# Altium schematic sheet Sheet3.SchDoc
size A1
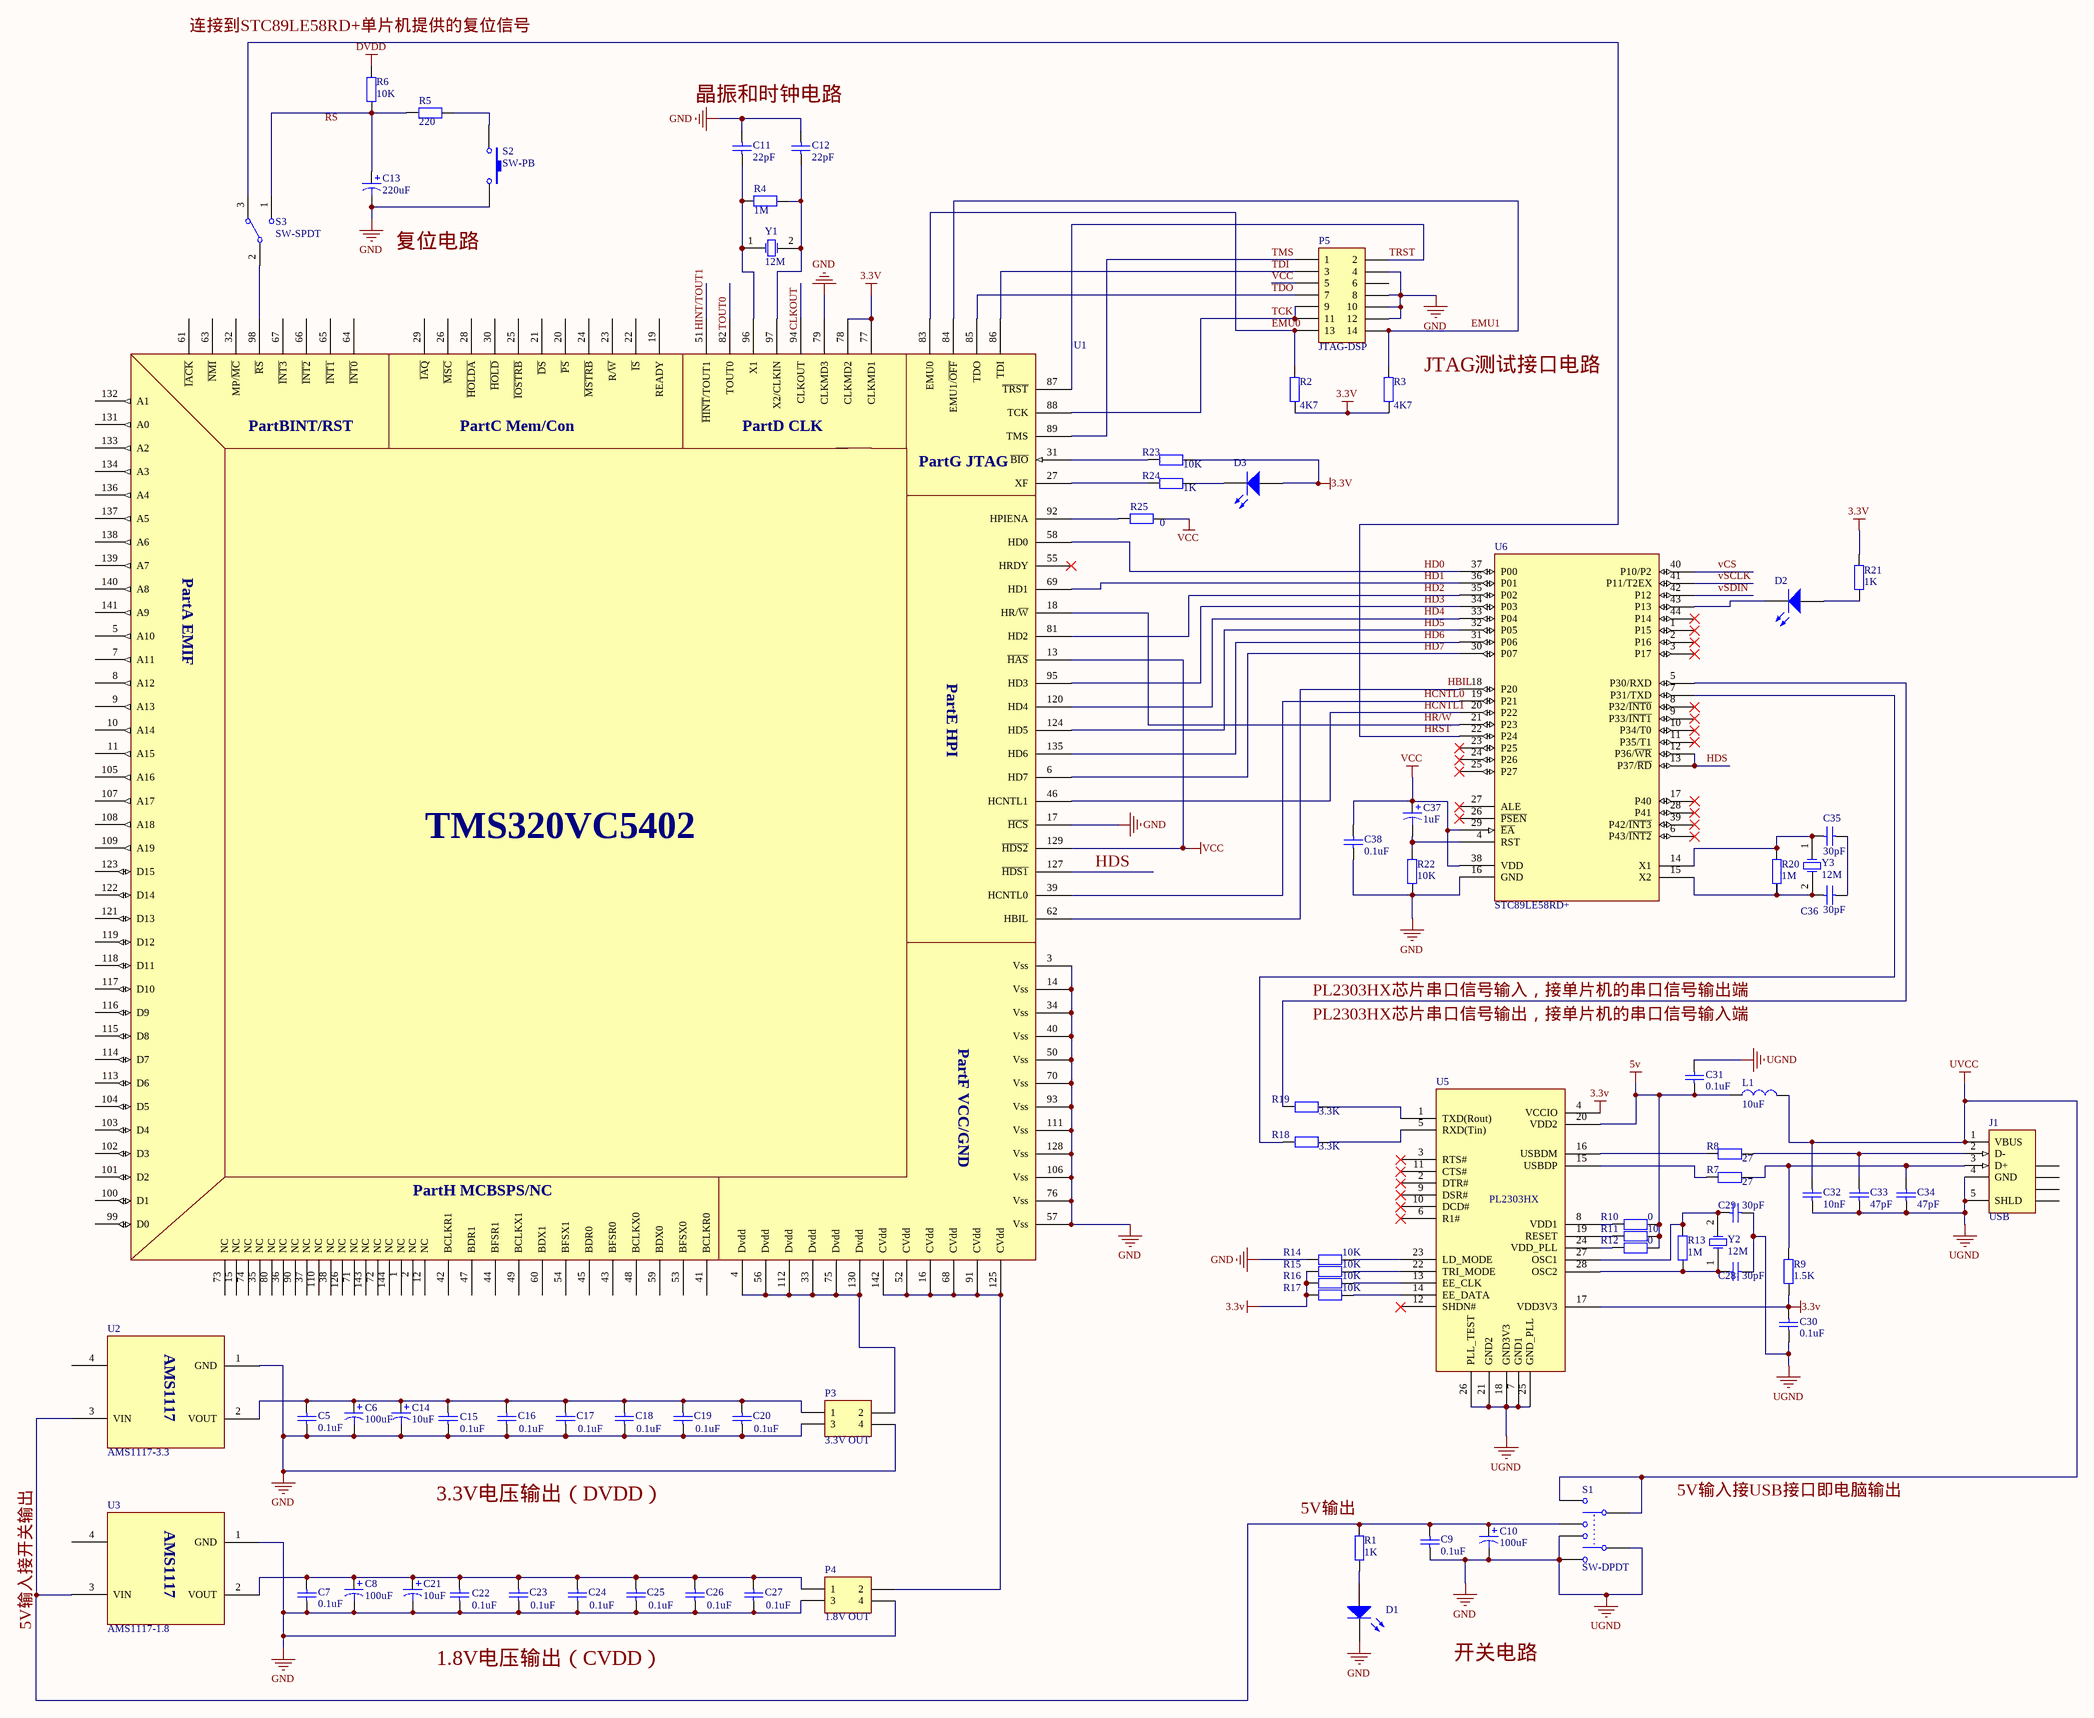
[diagram p0: Sheet3.SchDoc]

## Parts
C5  value 0.1uF  [RAD-0.3]  (hidden comment: Cap)
C6  value 100uF  [RB7.6-15]  (hidden comment: Cap Pol1)
C7  value 0.1uF  [RAD-0.3]  (hidden comment: Cap)
C8  value 100uF  [RB7.6-15]  (hidden comment: Cap Pol1)
C9  value 0.1uF  [RAD-0.3]  (hidden comment: Cap)
C10  value 100uF  [RB7.6-15]  (hidden comment: Cap Pol1)
C11  value 22pF  [RAD-0.3]  (hidden comment: Cap)
C12  value 22pF  [RAD-0.3]  (hidden comment: Cap)
C13  value 220uF  [RB7.6-15]  (hidden comment: Cap Pol1)
C14  value 10uF  [RB7.6-15]  (hidden comment: Cap Pol1)
C15  value 0.1uF  [RAD-0.3]  (hidden comment: Cap)
C16  value 0.1uF  [RAD-0.3]  (hidden comment: Cap)
C17  value 0.1uF  [RAD-0.3]  (hidden comment: Cap)
C18  value 0.1uF  [RAD-0.3]  (hidden comment: Cap)
C19  value 0.1uF  [RAD-0.3]  (hidden comment: Cap)
C20  value 0.1uF  [RAD-0.3]  (hidden comment: Cap)
C21  value 10uF  [RB7.6-15]  (hidden comment: Cap Pol1)
C22  value 0.1uF  [RAD-0.3]  (hidden comment: Cap)
C23  value 0.1uF  [RAD-0.3]  (hidden comment: Cap)
C24  value 0.1uF  [RAD-0.3]  (hidden comment: Cap)
C25  value 0.1uF  [RAD-0.3]  (hidden comment: Cap)
C26  value 0.1uF  [RAD-0.3]  (hidden comment: Cap)
C27  value 0.1uF  [RAD-0.3]  (hidden comment: Cap)
C28  value 30pF  [RAD-0.3]  (hidden comment: 28)
C29  value 30pF  [RAD-0.3]  (hidden comment: Cap)
C30  value 0.1uF  [RAD-0.3]  (hidden comment: Cap)
C31  value 0.1uF  [RAD-0.3]  (hidden comment: Cap)
C32  value 10nF  [RAD-0.3]  (hidden comment: Cap)
C33  value 47pF  [RAD-0.3]  (hidden comment: Cap)
C34  value 47pF  [RAD-0.3]  (hidden comment: Cap)
C35  value 30pF  [RAD-0.3]  (hidden comment: Cap)
C36  value 30pF  [RAD-0.3]  (hidden comment: 28)
C37  value 1uF  [RB7.6-15]  (hidden comment: Cap Pol1)
C38  value 0.1uF  [RAD-0.3]  (hidden comment: Cap)
D1  LED0  [LED-0]  (value not drawn)
D2  LED0  [LED-0]  (value not drawn)
D3  LED0  [LED-0]  (value not drawn)
J1  USB  [440247]
L1  10uF  [SLF10145]
P3  3.3V OUT  [HDR2X2]
P4  1.8V OUT  [HDR2X2]
P5  JTAG-DSP  [HDR2X7]
R1  value 1K  [AXIAL-0.4]  (hidden comment: Res2)
R2  value 4K7  [AXIAL-0.4]  (hidden comment: Res2)
R3  value 4K7  [AXIAL-0.4]  (hidden comment: Res2)
R4  value 1M  [AXIAL-0.4]  (hidden comment: Res2)
R5  value 220  [AXIAL-0.4]  (hidden comment: Res2)
R6  value 10K  [AXIAL-0.4]  (hidden comment: Res2)
R7  value 27  [AXIAL-0.4]  (hidden comment: Res2)
R8  value 27  [AXIAL-0.4]  (hidden comment: Res2)
R9  value 1.5K  [AXIAL-0.4]  (hidden comment: Res2)
R10  value 0  [AXIAL-0.4]  (hidden comment: Res2)
R11  value 10  [AXIAL-0.4]  (hidden comment: Res2)
R12  value 0  [AXIAL-0.4]  (hidden comment: Res2)
R13  value 1M  [AXIAL-0.4]  (hidden comment: Res2)
R14  value 10K  [AXIAL-0.4]  (hidden comment: Res2)
R15  value 10K  [AXIAL-0.4]  (hidden comment: Res2)
R16  value 10K  [AXIAL-0.4]  (hidden comment: Res2)
R17  value 10K  [AXIAL-0.4]  (hidden comment: Res2)
R18  value 3.3K  [AXIAL-0.4]  (hidden comment: Res2)
R19  value 3.3K  [AXIAL-0.4]  (hidden comment: Res2)
R20  value 1M  [AXIAL-0.4]  (hidden comment: Res2)
R21  value 1K  [AXIAL-0.4]  (hidden comment: Res2)
R22  value 10K  [AXIAL-0.4]  (hidden comment: Res2)
R23  value 10K  [AXIAL-0.4]  (hidden comment: Res2)
R24  value 1K  [AXIAL-0.4]  (hidden comment: Res2)
R25  value 0  [AXIAL-0.4]  (hidden comment: Res2)
S1  SW-DPDT  [DPDT-6]
S2  SW-PB  [SPST-2]
S3  SW-SPDT  [TL36WW15050]
U1  Component_1  (value not drawn)
U2  AMS1117-3.3
U3  AMS1117-1.8
U5  PL2303HX
U6  STC89LE58RD+
Y1  12M  [R38]
Y2  12M  [R38]
Y3  12M  [R38]

## Nets
3.3v: C30.2 D3.1(A) R2.1 R3.1 R9.1 R15.1 R16.1 R17.1 R21.2 R23.2 U1.77(CLKMD1) U1.78(CLKMD2) U5.4(VCCIO) U5.17(VDD3V3)
5v: C31.2 L1.2 R10.2 R11.2 R12.2 U5.20(VDD2)
DVDD: R6.2
GND: C5.1 C6.2 C7.1 C8.2 C9.1 C10.2 C11.1 C12.1 C13.2 C14.2 C15.1 C16.1 C17.1 C18.1 C19.1 C20.1 C21.2 C22.1 C23.1 C24.1 C25.1 C26.1 C27.1 C28.2 C29.2 C30.1 C31.1 C32.1 C33.1 C34.2 C38.1 D1.2(K) J1.4(GND) J1.5(SHLD) P3.3 P3.4 P4.3 P4.4 P5.4 P5.8 P5.10 P5.12 R14.1 R22.1 S1.1 S1.2 S1.3 S2.2 U1.3(Vss) U1.14(Vss) U1.17(~{HCS}) U1.34(Vss) U1.40(Vss) U1.50(Vss) U1.57(Vss) U1.70(Vss) U1.76(Vss) U1.79(CLKMD3) U1.93(Vss) U1.106(Vss) U1.111(Vss) U1.128(Vss) U2.1(GND) U3.1(GND) U5.7(GND1) U5.18(GND3V3) U5.21(GND2) U5.25(GND_PLL) U5.26(PLL_TEST) U6.16(GND)  [also labelled UGND]
UVCC: C32.2 J1.1(VBUS) L1.1 S1.4 S1.6
VCC: C37.1 C38.2 R25.2 U1.13(~{HAS}) U1.129(~{HDS2}) U6.29(~{EA}) U6.38(VDD)
NetC5_2: C5.2 C6.1 C14.1 C15.2 C16.2 C17.2 C18.2 C19.2 C20.2 P3.1 U2.2(VOUT)
NetC7_2: C7.2 C8.1 C21.1 C22.2 C23.2 C24.2 C25.2 C26.2 C27.2 P4.1 U3.2(VOUT)
NetC9_2: C9.2 C10.1 R1.1 S1.5 U2.3(VIN) U3.3(VIN)
NetC11_2: C11.2 R4.2 U1.96(X1) Y1.1(OSC1)
NetC12_2: C12.2 R4.1 U1.97(X2/CLKIN) Y1.2(OSC2)
NetC13_1: C13.1 R5.1 R6.1 S3.1
NetC28_1: C28.1 R13.1 U5.28(OSC2) Y2.1(OSC1)
NetC29_1: C29.1 R13.2 U5.27(OSC1) Y2.2(OSC2)
NetC33_2: C33.2 J1.2(D-) R8.2
NetC34_1: C34.1 J1.3(D+) R7.2 R9.2
NetC35_1: C35.1 R20.2 U6.14(X1) Y3.1(OSC1)
NetC35_2: C35.2 C36.2
NetC36_1: C36.1 R20.1 U6.15(X2) Y3.2(OSC2)
NetC37_2: C37.2 R22.2 U6.4(RST)
NetD1_1: D1.1(A) R1.2
NetD2_1: D2.1(A) R21.1
NetD2_2: D2.2(K) U6.43(P13)
NetD3_2: D3.2(K) R24.2
NetP3_2: P3.2 U1.4(Dvdd) U1.33(Dvdd) U1.56(Dvdd) U1.75(Dvdd) U1.112(Dvdd) U1.130(Dvdd)
NetP4_2: P4.2 U1.16(CVdd) U1.52(CVdd) U1.68(CVdd) U1.91(CVdd) U1.125(CVdd) U1.142(CVdd)
NetP5_1: P5.1 U1.89(TMS)
NetP5_2: P5.2 U1.87(~{TRST})
NetP5_3: P5.3 U1.86(TDI)
NetP5_7: P5.7 U1.85(TDO)
NetP5_9: P5.9 P5.11 U1.88(TCK)
NetP5_13: P5.13 R2.2 U1.83(EMU0)
NetP5_14: P5.14 R3.2 U1.84(EMU1/~{OFF})
NetR5_2: R5.2 S2.1
NetR7_1: R7.1 U5.15(USBDP)
NetR8_1: R8.1 U5.16(USBDM)
NetR10_1: R10.1 U5.8(VDD1)
NetR11_1: R11.1 U5.19(RESET)
NetR12_1: R12.1 U5.24(VDD_PLL)
NetR14_2: R14.2 U5.23(LD_MODE)
NetR15_2: R15.2 U5.22(TRI_MODE)
NetR16_2: R16.2 U5.13(EE_CLK)
NetR17_2: R17.2 U5.14(EE_DATA)
NetR18_1: R18.1 U6.7(P31/TXD)
NetR18_2: R18.2 U5.5(RXD(Tin))
NetR19_1: R19.1 U6.5(P30/RXD)
NetR19_2: R19.2 U5.1(TXD(Rout))
NetR23_1: R23.1 U1.31(~{BIO})
NetR24_1: R24.1 U1.27(XF)
NetR25_1: R25.1 U1.92(HPIENA)
NetS3_2: S3.2 U1.98(~{RS})
NetS3_3: S3.3 U6.22(P24)
NetU1_6: U1.6(HD7) U6.30(P07)
NetU1_18: U1.18(HR/~{W}) U6.21(P23)
NetU1_39: U1.39(HCNTL0) U6.19(P21)
NetU1_46: U1.46(HCNTL1) U6.20(P22)
NetU1_58: U1.58(HD0) U6.37(P00)
NetU1_62: U1.62(HBIL) U6.18(P20)
NetU1_69: U1.69(HD1) U6.36(P01)
NetU1_81: U1.81(HD2) U6.35(P02)
NetU1_95: U1.95(HD3) U6.34(P03)
NetU1_120: U1.120(HD4) U6.33(P04)
NetU1_124: U1.124(HD5) U6.32(P05)
NetU1_135: U1.135(HD6) U6.31(P06)
NetU6_12: U6.12(P36/~{WR}) U6.13(P37/~{RD})

Not connected (* = marked no-connect by the designer): J1 6(SHLD) 7(SHLD) 8(SHLD) 9(SHLD); P5 5 6; U1 1(NC) 2(NC) 5(A10) 7(A11) 8(A12) 9(A13) 10(A14) 11(A15) 12(NC) 15(NC) 19(READY) 20(~{PS}) 21(~{DS}) 22(~{IS}) 23(R/~{W}) 24(~{MSTRB}) 25(~{IOSTRB}) 26(~{MSC}) 28(~{HOLDA}) 29(~{IAQ}) 30(~{HOLD}) 32(MP/~{MC}) 35(NC) 36(NC) 37(NC) 38(NC) 41(BCLKR0) 42(BCLKR1) 43(BFSR0) 44(BFSR1) 45(BDR0) 47(BDR1) 48(BCLKX0) 49(BCLKX1) 51(~{HINT}/TOUT1) 53(BFSX0) 54(BFSX1) 55(HRDY)* 59(BDX0) 60(BDX1) 61(~{IACK}) 63(~{NMI}) 64(~{INT0}) 65(~{INT1}) 66(~{INT2}) 67(~{INT3}) 71(NC) 72(NC) 73(NC) 74(NC) 80(NC) 82(TOUT0) 90(NC) 94(CLKOUT) 99(D0) 100(D1) 101(D2) 102(D3) 103(D4) 104(D5) 105(A16) 107(A17) 108(A18) 109(A19) 110(NC) 113(D6) 114(D7) 115(D8) 116(D9) 117(D10) 118(D11) 119(D12) 121(D13) 122(D14) 123(D15) 126(NC) 127(~{HDS1}) 131(A0) 132(A1) 133(A2) 134(A3) 136(A4) 137(A5) 138(A6) 139(A7) 140(A8) 141(A9) 143(NC) 144(NC); U2 4(3); U3 4(3); U5 2(DTR#)* 3(RTS#)* 6(R1#)* 9(DSR#)* 10(DCD#)* 11(CTS#)* 12(SHDN#)*; U6 1(P15)* 2(P16)* 3(P17)* 6(P43/~{INT2})* 8(P32/~{INT0})* 9(P33/~{INT1})* 10(P34/T0)* 11(P35/T1)* 17(P40)* 23(P25)* 24(P26)* 25(P27)* 26(~{PSEN})* 27(ALE)* 28(P41)* 39(P42/~{INT3})* 40(P10/P2) 41(P11/T2EX) 42(P12) 44(P14)*

## Notes on the sheet
- (near R6) 连接到STC89LE58RD+单片机提供的复位信号
- (near R6) RS
- (near P5) TMS
- (near P5) TDI
- (near P5) VCC
- (near P5) TRST
- (near U1) HINT/TOUT1
- (near U1) TOUT0
- (near U1) CLKOUT
- (near P5) TDO
- (near P5) TCK
- (near P5) EMU0
- EMU1
- HD0
- HD1
- vCS
- vSCLK
- HD2
- HD3
- HD4
- HD5
- vSDIN
- HD6
- HD7
- (near U6) HCNTL0
- HBIL
- (near U6) HCNTL1
- HR/W
- HRST
- HDS
- PL2303HX芯片串口信号输出，接单片机的串口信号输入端
- PL2303HX芯片串口信号输入，接单片机的串口信号输出端
- (near R1) 5V输出
- 5V输入接USB接口即电脑输出
- 5V输入接开关输出
- Labels drawn without touching a wire or pin: 1.8V电压输出（CVDD）, 3.3V电压输出（DVDD）, JTAG测试接口电路, 复位电路, 开关电路, 晶振和时钟电路
- (in symbol Component_1) PartBINT/RST; PartC Mem/Con; PartD CLK; PartG JTAG; PartA EMIF; PartE HPI; TMS320VC5402; PartF VCC/GND; PartH MCBSPS/NC

## Library data of the parts
C5 C7 C9 C11 C12 C15-C20 C22-C36 C38 = Cap: Capacitor; Published: 8-Jun-2000; LatestRevisionDate: 17-Jul-2002; LatestRevisionNote: Re-released for DXP Platform.; PackageReference: RAD-0.3; Publisher: Altium Limited
C6 C8 C10 C13 C14 C21 C37 = Cap Pol1: Polarized Capacitor (Radial); Published: 8-Jun-2000; LatestRevisionDate: 17-Jul-2002; LatestRevisionNote: Re-released for DXP Platform.; PackageReference: RB7.6-15; Publisher: Altium Limited
D1-D3 = LED0: Typical INFRARED GaAs LED; Published: 8-Jun-2000; LatestRevisionDate: 08-Jul-2005; LatestRevisionNote: Mech Layer 1 removed.; PackageReference: LED-0; Publisher: Altium Limited
J1 = 440247-1: USB 2.0, Right Angle, SMT, B Type, Receptacle, 5 Position, Black; ContactMaterial: Copper Alloy; ContactPlating: Gold (30); PCB_Layout: Complies with manufacturer's recommendation.; DrillSize: Corresponds to nominal value.; PanelGround: Without; Published: 15-Jul-2004; DatasheetDocument: 27-Jun-2003; PackageDocument: 27-Jun-2003; PackageReference: 440247; Publisher: Altium Limited; HousingMaterial: Thermoplastic; ComponentLink1Description: Manufacturer Link; ComponentLink1URL: http://www.tycoelectronics.com/; ComponentLink2Description: Packaging Specification; ComponentLink2URL: http://ecommas.tycoelectronics.com/commerce/DocumentDelivery/DDEController?Action=showdoc&DocId=Customer+Drawing%7F440247%7FD%7Fpdf%7FEnglish%7FC_440247_D.pdf
L1 = L1: 电感
P3 P4 = Header 2X2: Header, 2-Pin, Dual row; LatestRevisionDate: 17-Jul-2002; LatestRevisionNote: Re-released for DXP Platform.; Publisher: Altium Limited
P5 = Header 7X2: Header, 7-Pin, Dual row; LatestRevisionDate: 17-Jul-2002; LatestRevisionNote: Re-released for DXP Platform.; Publisher: Altium Limited
R1-R25 = Res2: Resistor; Published: 8-Jun-2000; LatestRevisionDate: 17-Jul-2002; LatestRevisionNote: Re-released for DXP Platform.; PackageReference: AXIAL-0.4; Publisher: Altium Limited
S1 = SW-DPDT: Double-Pole, Double-Throw Switch; Published: 24-Mar-1999; LatestRevisionDate: 17-Jul-2002; LatestRevisionNote: Re-released for DXP Platform.; PackageReference: DPDT-6; Publisher: Altium Limited
S2 = SW-PB: Switch; Published: 24-Mar-1999; LatestRevisionDate: 17-Jul-2002; LatestRevisionNote: Re-released for DXP Platform.; PackageReference: SPST-2; Publisher: Altium Limited
S3 = SW-SPDT: SPDT Subminiature Toggle Switch, Right Angle Mounting, Vertical Actuation; Published: 24-Mar-1999; LatestRevisionDate: 17-Dec-2003; LatestRevisionNote: Schematic revised, PCB Footprint replaced.; DatasheetDocument: 05-Dec-2000; PackageReference: TL36WW15050; Publisher: Altium Limited; ComponentLink1Description: Manufacturer Link; ComponentLink1URL: http://www.apem.com
U2 U3 = AMS1117
Y1-Y3 = XTAL: Crystal Oscillator; Published: 8-Jun-2000; LatestRevisionDate: 17-Jul-2002; LatestRevisionNote: Re-released for DXP Platform.; PackageReference: R38; Publisher: Altium Limited